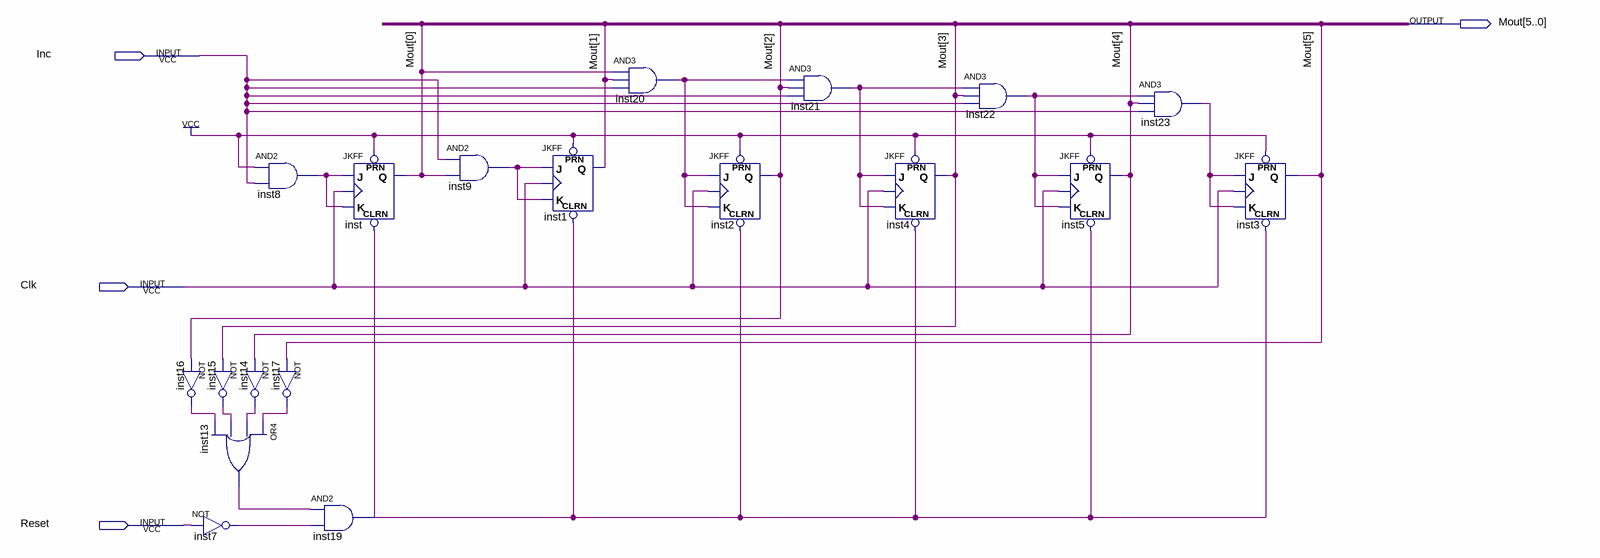
[diagram p0: schematic sheet]
// Quartus schematic sixbit_inc_register.bdf as structural Verilog: 19 symbols, 4 pins
module sixbit_inc_register (
  input  Inc,
  input  Clk,
  input  Reset,
  output [5:0] Mout
);

  wire inst7_out, inst8_out, inst9_out, inst13_out, inst14_out, inst15_out, inst16_out, inst17_out,
       inst19_out, inst20_out, inst21_out, inst22_out, inst23_out;

  not inst15 (inst15_out, Mout[3]);
  not inst16 (inst16_out, Mout[2]);
  or inst13 (inst13_out, inst17_out, inst14_out, inst15_out, inst16_out);
  not inst7 (inst7_out, Reset);
  and inst8 (inst8_out, 1'b1, Inc);
  not inst14 (inst14_out, Mout[4]);
  not inst17 (inst17_out, Mout[5]);
  JKFF inst (.PRN(1'b1), .CLRN(inst19_out), .K(inst8_out), .J(inst8_out), .CLK(Clk), .Q(Mout[0]));
  and inst19 (inst19_out, inst13_out, inst7_out);
  and inst9 (inst9_out, Inc, Mout[0]);
  JKFF inst1 (.PRN(1'b1), .CLRN(inst19_out), .K(inst9_out), .J(inst9_out), .CLK(Clk), .Q(Mout[1]));
  and inst20 (inst20_out, Mout[0], Mout[1], Inc);
  JKFF inst2 (.PRN(1'b1), .CLRN(inst19_out), .K(inst20_out), .J(inst20_out), .CLK(Clk), .Q(Mout[2]));
  and inst21 (inst21_out, inst20_out, Mout[2], Inc);
  JKFF inst4 (.PRN(1'b1), .CLRN(inst19_out), .K(inst21_out), .J(inst21_out), .CLK(Clk), .Q(Mout[3]));
  and inst22 (inst22_out, inst21_out, Mout[3], Inc);
  JKFF inst5 (.PRN(1'b1), .CLRN(inst19_out), .K(inst22_out), .J(inst22_out), .CLK(Clk), .Q(Mout[4]));
  and inst23 (inst23_out, inst22_out, Mout[4], Inc);
  JKFF inst3 (.PRN(1'b1), .CLRN(inst19_out), .K(inst23_out), .J(inst23_out), .CLK(Clk), .Q(Mout[5]));
endmodule
